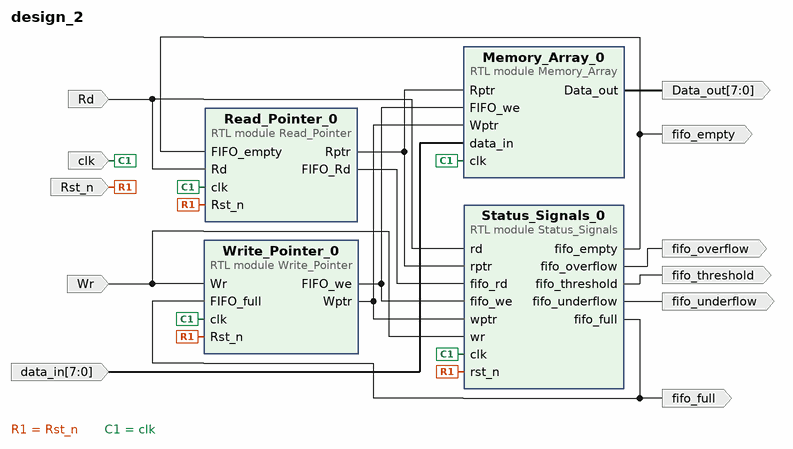
[diagram p0: block diagram of the top level]
# Vivado block design design_2, xc7a35tcpg236-1, Vivado 2021.1
create_bd_design design_2

create_bd_port -dir I -from 7 -to 0 data_in
create_bd_port -dir I -type clk clk
set_property -dict {CONFIG.FREQ_HZ 100000000} [get_bd_ports clk]
create_bd_port -dir O -from 7 -to 0 Data_out
create_bd_port -dir I -type rst Rst_n
create_bd_port -dir I Rd
create_bd_port -dir O fifo_empty
create_bd_port -dir O fifo_full
create_bd_port -dir O fifo_threshold
create_bd_port -dir O fifo_overflow
create_bd_port -dir O fifo_underflow
create_bd_port -dir I Wr

create_bd_cell -type module -reference Memory_Array Memory_Array_0
create_bd_cell -type module -reference Read_Pointer Read_Pointer_0
create_bd_cell -type module -reference Status_Signals Status_Signals_0
create_bd_cell -type module -reference Write_Pointer Write_Pointer_0

# ---- connections ----

connect_bd_net [get_bd_pins Memory_Array_0/Data_out] [get_bd_ports Data_out]
connect_bd_net [get_bd_ports Rd] [get_bd_pins Read_Pointer_0/Rd] [get_bd_pins Status_Signals_0/rd]
connect_bd_net [get_bd_pins Read_Pointer_0/FIFO_Rd] [get_bd_pins Status_Signals_0/fifo_rd]
connect_bd_net [get_bd_pins Read_Pointer_0/Rptr] [get_bd_pins Memory_Array_0/Rptr] [get_bd_pins Status_Signals_0/rptr]
connect_bd_net [get_bd_ports Rst_n] [get_bd_pins Read_Pointer_0/Rst_n] [get_bd_pins Write_Pointer_0/Rst_n] [get_bd_pins Status_Signals_0/rst_n]
connect_bd_net [get_bd_pins Status_Signals_0/fifo_empty] [get_bd_pins Read_Pointer_0/FIFO_empty] [get_bd_ports fifo_empty]
connect_bd_net [get_bd_pins Status_Signals_0/fifo_full] [get_bd_ports fifo_full] [get_bd_pins Write_Pointer_0/FIFO_full]
connect_bd_net [get_bd_pins Status_Signals_0/fifo_overflow] [get_bd_ports fifo_overflow]
connect_bd_net [get_bd_pins Status_Signals_0/fifo_threshold] [get_bd_ports fifo_threshold]
connect_bd_net [get_bd_pins Status_Signals_0/fifo_underflow] [get_bd_ports fifo_underflow]
connect_bd_net [get_bd_ports Wr] [get_bd_pins Write_Pointer_0/Wr] [get_bd_pins Status_Signals_0/wr]
connect_bd_net [get_bd_pins Write_Pointer_0/FIFO_we] [get_bd_pins Memory_Array_0/FIFO_we] [get_bd_pins Status_Signals_0/fifo_we]
connect_bd_net [get_bd_pins Write_Pointer_0/Wptr] [get_bd_pins Status_Signals_0/wptr] [get_bd_pins Memory_Array_0/Wptr]
connect_bd_net [get_bd_ports clk] \
  [get_bd_pins Memory_Array_0/clk] [get_bd_pins Read_Pointer_0/clk] [get_bd_pins Write_Pointer_0/clk] \
  [get_bd_pins Status_Signals_0/clk]
connect_bd_net [get_bd_ports data_in] [get_bd_pins Memory_Array_0/data_in]

validate_bd_design
save_bd_design
